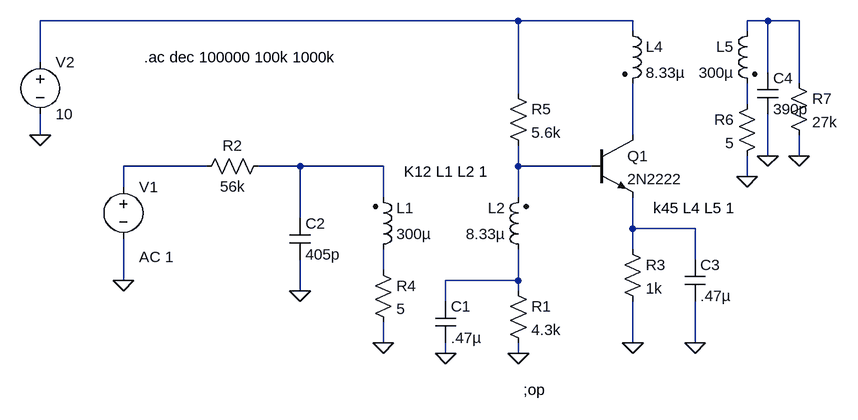
[diagram p0: schematic sinto simple1.asc]
sinto simple1.asc, the LTspice schematic file:
Version 4
SHEET 1 880 680
WIRE 224 -176 -512 -176
WIRE 400 -176 224 -176
WIRE 608 -176 576 -176
WIRE 656 -176 608 -176
WIRE 400 -160 400 -176
WIRE 576 -160 576 -176
WIRE -512 -112 -512 -176
WIRE 608 -96 608 -176
WIRE 656 -80 656 -176
WIRE 224 -64 224 -176
WIRE 576 -48 576 -80
WIRE -512 0 -512 -32
WIRE 400 0 400 -80
WIRE 608 32 608 -32
WIRE 656 32 656 0
WIRE -256 48 -384 48
WIRE -112 48 -176 48
WIRE 16 48 -112 48
WIRE 224 48 224 16
WIRE 336 48 224 48
WIRE 576 64 576 32
WIRE -384 80 -384 48
WIRE 16 96 16 48
WIRE 224 96 224 48
WIRE -112 128 -112 48
WIRE 400 144 400 96
WIRE 496 144 400 144
WIRE 400 176 400 144
WIRE 496 192 496 144
WIRE 16 208 16 176
WIRE -384 224 -384 160
WIRE 224 224 224 176
WIRE 224 224 112 224
WIRE -112 240 -112 192
WIRE 224 240 224 224
WIRE 112 256 112 224
WIRE 16 320 16 288
WIRE 400 320 400 256
WIRE 496 320 496 256
WIRE 112 336 112 320
WIRE 224 336 224 320
FLAG 400 320 0
FLAG 496 320 0
FLAG -512 0 0
FLAG 224 336 0
FLAG 16 320 0
FLAG -384 224 0
FLAG -112 240 0
FLAG 112 336 0
FLAG 576 64 0
FLAG 656 32 0
FLAG 608 32 0
SYMBOL npn 336 0 R0
SYMATTR InstName Q1
SYMATTR Value 2N2222
SYMBOL res 384 160 R0
SYMATTR InstName R3
SYMATTR Value 1k
SYMBOL cap 480 192 R0
SYMATTR InstName C3
SYMATTR Value .47µ
SYMBOL res 208 224 R0
SYMATTR InstName R1
SYMATTR Value 4.3k
SYMBOL res 208 -80 R0
SYMATTR InstName R5
SYMATTR Value 5.6k
SYMBOL voltage -512 -128 R0
WINDOW 123 0 0 Left 2
WINDOW 39 0 0 Left 2
SYMATTR InstName V2
SYMATTR Value 10
SYMBOL cap 96 256 R0
SYMATTR InstName C1
SYMATTR Value .47µ
SYMBOL res -160 32 R90
WINDOW 0 0 56 VBottom 2
WINDOW 3 32 56 VTop 2
SYMATTR InstName R2
SYMATTR Value 56k
SYMBOL voltage -384 64 R0
WINDOW 123 24 124 Left 2
WINDOW 39 0 0 Left 2
SYMATTR Value2 AC 1
SYMATTR InstName V1
SYMATTR Value ""
SYMBOL cap -128 128 R0
SYMATTR InstName C2
SYMATTR Value 405p
SYMBOL ind2 0 192 M180
WINDOW 0 36 80 Left 2
WINDOW 3 36 40 Left 2
SYMATTR InstName L1
SYMATTR Value 300µ
SYMBOL ind2 240 192 R180
WINDOW 0 36 80 Left 2
WINDOW 3 36 40 Left 2
SYMATTR InstName L2
SYMATTR Value 8.33µ
SYMBOL res 0 192 R0
SYMATTR InstName R4
SYMATTR Value 5
SYMBOL ind2 384 -176 R0
SYMATTR InstName L4
SYMATTR Value 8.33µ
SYMBOL ind2 592 -176 M0
SYMATTR InstName L5
SYMATTR Value 300µ
SYMBOL res 592 -64 M0
SYMATTR InstName R6
SYMATTR Value 5
SYMBOL res 640 -96 R0
SYMATTR InstName R7
SYMATTR Value 27k
SYMBOL cap 592 -96 R0
SYMATTR InstName C4
SYMATTR Value 390p
TEXT 232 392 Left 2 !;op
TEXT 48 56 Left 2 !K12 L1 L2 1
TEXT -352 -120 Left 2 !.ac dec 100000 100k 1000k
TEXT 432 112 Left 2 !k45 L4 L5 1

The netlist it stands for:
* sinto simple1.asc
Q1 N004 N007 N008 0 2N2222
R3 N008 0 1k
C3 N008 0 .47µ
R1 N010 0 4.3k
R5 N001 N007 5.6k
V2 N001 0 10
C1 N010 0 .47µ
R2 N006 N005 56k
V1 N005 0 AC 1
C2 N006 0 405p
L1 N009 N006 300µ
L2 N010 N007 8.33µ
R4 N009 0 5
L4 N001 N004 8.33µ
L5 N002 N003 300µ
R6 N003 0 5
R7 N002 0 27k
C4 N002 0 390p
.model NPN NPN
.model PNP PNP
.lib standard.bjt
;op
K12 L1 L2 1
.ac dec 100000 100k 1000k
k45 L4 L5 1
.backanno
.end